# Altium project Power.PrjPcb
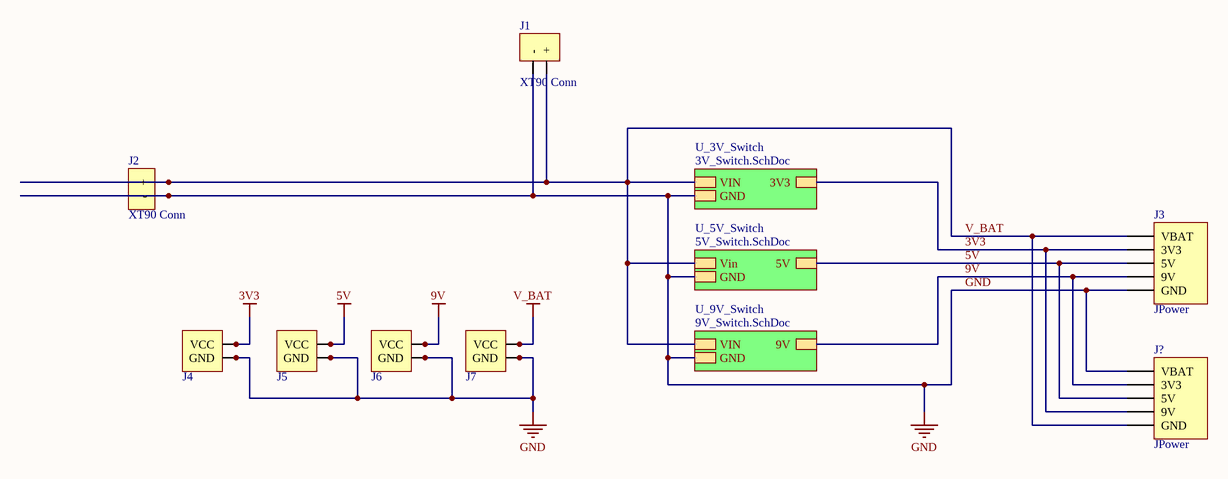
[diagram p0: Top.SchDoc]
1 sheet, 8 parts. Net scope: hierarchical (ports join the sheet entries above them; power ports are global).
Board file: Power.PcbDoc

## Sheet Top.SchDoc
size A

### Parts
J1  XT90 Conn  [XT90]
J2  XT90 Conn  [XT90]
J3  JPower  [FX30B-5S-3.81DS]
J4  PWR4x1V  [37212-62M3-003PL]  (value not drawn)
J5  PWR4x1V  [37212-62M3-003PL]  (value not drawn)
J6  PWR4x1V  [37212-62M3-003PL]  (value not drawn)
J7  PWR4x1V  [37212-62M3-003PL]  (value not drawn)
J?1  JPower  [FX30B-5S-3.81DS]

### Sub-sheets
U_3V_Switch = 3V_Switch.SchDoc (file not in this document): VIN, 3V3, GND
U_5V_Switch = 5V_Switch.SchDoc (file not in this document): 5V, Vin, GND
U_9V_Switch = 9V_Switch.SchDoc (file not in this document): VIN, GND, 9V

### Nets
3V3: J3.4(3V3) J4.1 J4.4 J4.7 J4.10(VCC) J?1.2(9V) ; sheet U_3V_Switch/3V3
5V: J3.3(5V) J5.1 J5.4 J5.7 J5.10(VCC) J?1.3(5V) ; sheet U_5V_Switch/5V
9V: J3.2(9V) J6.1 J6.4 J6.7 J6.10(VCC) J?1.4(3V3) ; sheet U_9V_Switch/9V
GND: J1.2(-) J2.2(-) J3.1(GND) J4.2 J4.5 J4.8 J4.11(GND) J5.2 J5.5 J5.8 J5.11(GND) J6.2 J6.5 J6.8 J6.11(GND) J7.2 J7.5 J7.8 J7.11(GND) J?1.5(VBAT) ; sheet U_3V_Switch/GND, sheet U_5V_Switch/GND, sheet U_9V_Switch/GND
V_BAT: J1.1(+) J2.1(+) J3.5(VBAT) J7.1 J7.4 J7.7 J7.10(VCC) J?1.1(GND) ; sheet U_3V_Switch/VIN, sheet U_5V_Switch/Vin, sheet U_9V_Switch/VIN

### Library data of the parts
J1 J2 = XT90
J3 J? = JPower: Supplier 1: Digi-Key; Supplier Part Number 1: H122216-ND; Supplier 2: Digi-Key; Supplier Part Number 2: H122224-ND
J4-J7 = PWR4x1V: Supplier 1: Digi-Key; Supplier Part Number 1: 3M5717-ND

## Assembly variants
Power - Thrusters: all parts fitted
Power - Main: all parts fitted